# EAGLE schematic devboard_kw2xd_v2.0 (EAGLE 8.4.1)
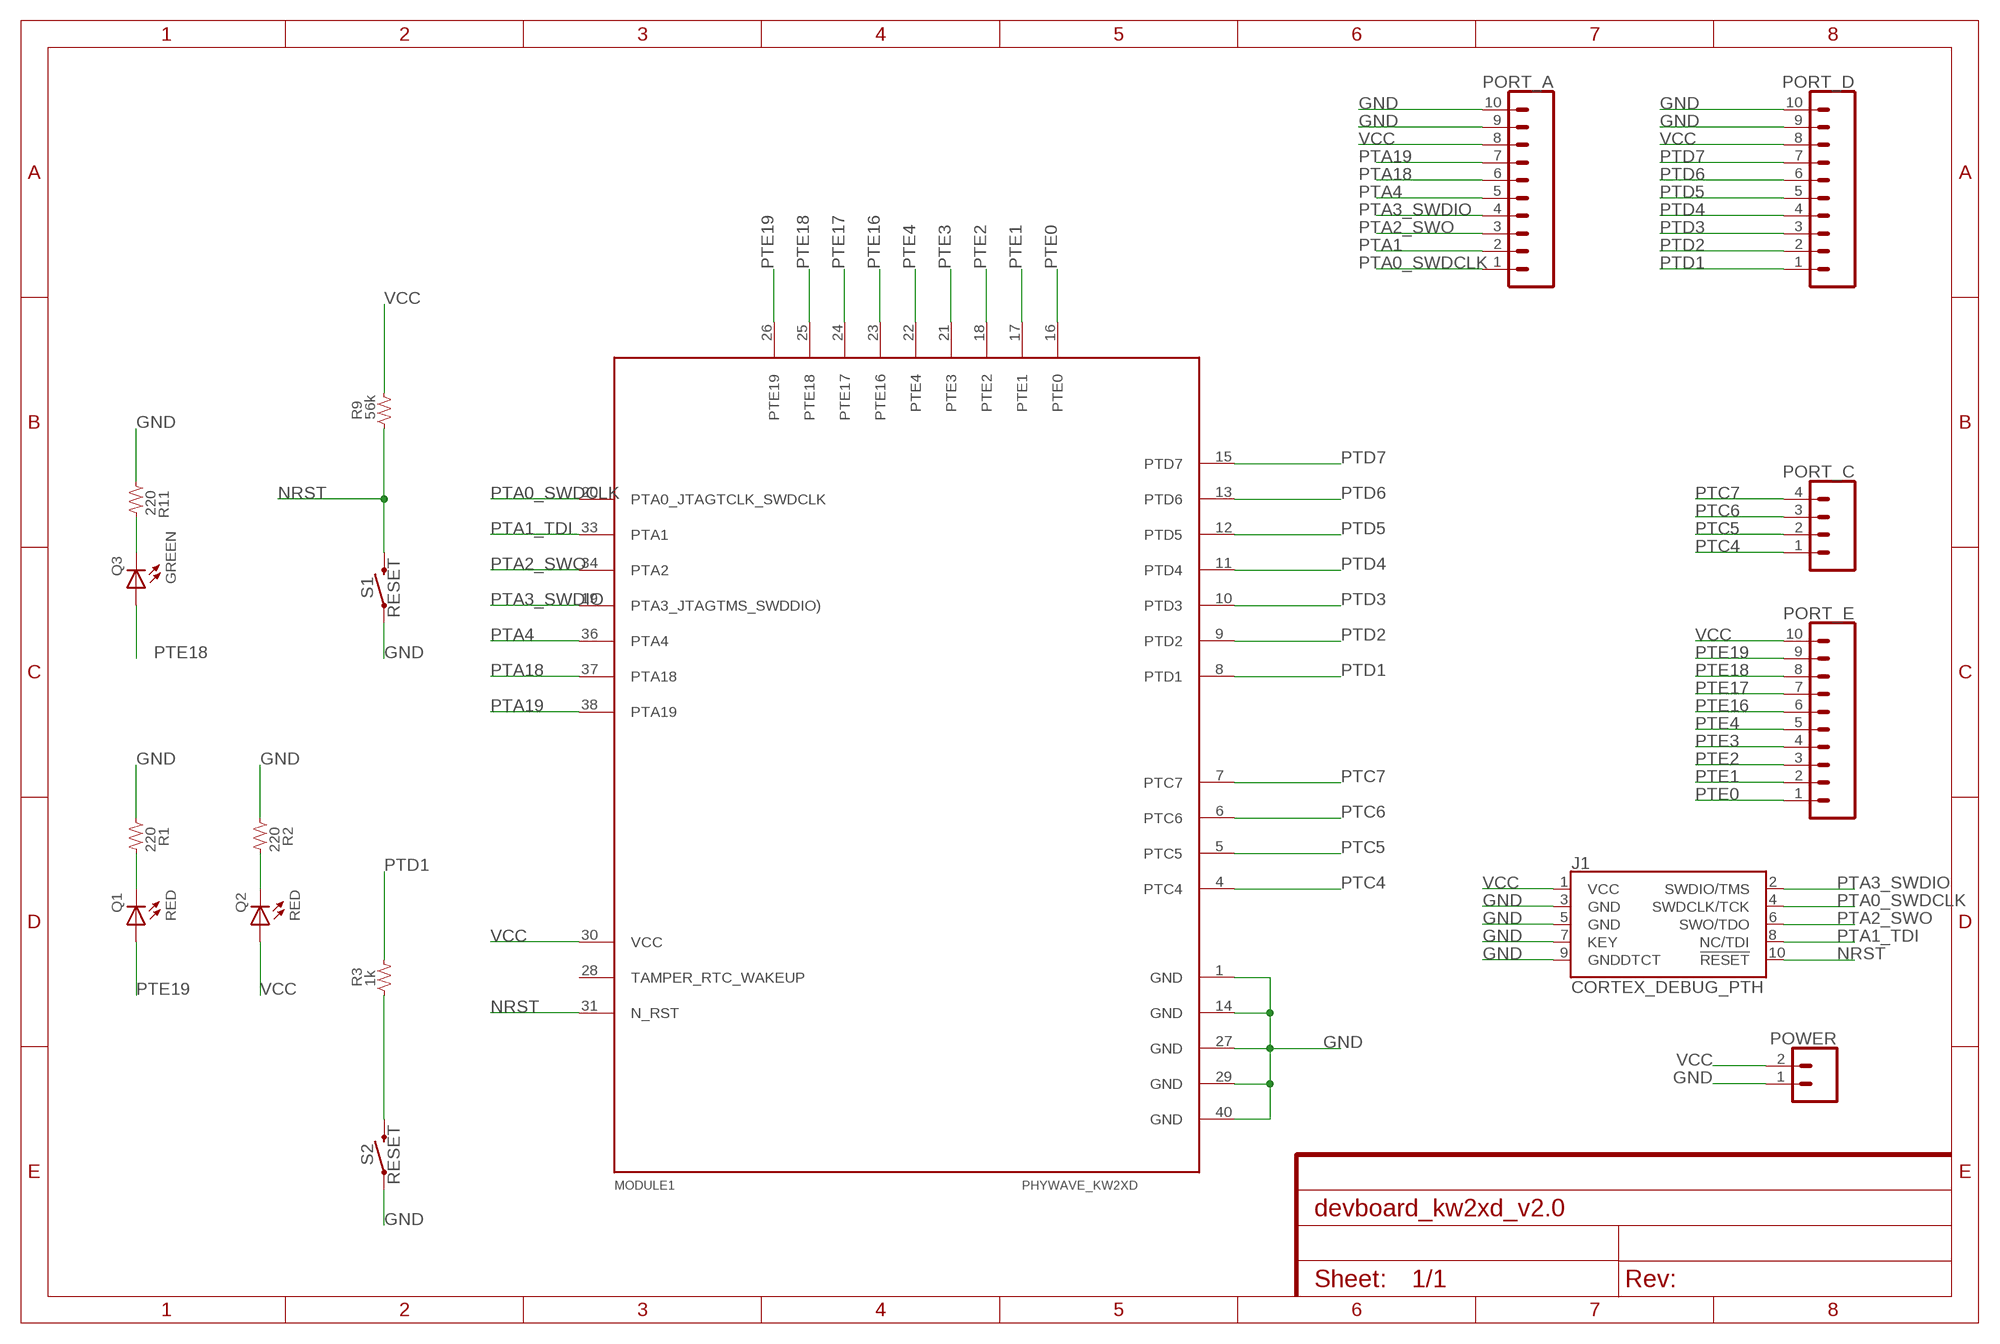
[diagram p0: schematic, sheet 1]
FRAME1 (FRAME-A4L): CNAME: OFLMote KW2xD Dev. Board; CREVISION: v1.0; DESIGNER: O.Fauchon - OFLMetrics 2018

## Parts
J1  CORTEX_DEBUG_PTH  [2X5-PTH-1.27MM]
MODULE1  PHYWAVE_KW2XD  [PHYWAVE_KW2XD]
PORT_A  CONN_10"  [1X10]
PORT_C  CONN_04  [1X04]
PORT_D  CONN_10"  [1X10]
PORT_E  CONN_10"  [1X10]
POWER  CONN_02  [1X02]
Q1  RED  LED-0603  [LED0603]
Q2  RED  LED-0603  [LED0603]
Q3  GREEN  LED-0603  [LED0603]
R1  220  R-0603  [SMD0603]
R2  220  R-0603  [SMD0603]
R3  1k  R-0603  [SMD0603]
R9  56k  R-0603  [SMD0603]
R11  220  R-0603  [SMD0603]
S1  RESET  MOMENTARY-SWITCH-SPST-SMD-4.6X2.8MM  [TACTILE_SWITCH_SMD_4.6X2.8MM]
S2  RESET  MOMENTARY-SWITCH-SPST-SMD-4.6X2.8MM  [TACTILE_SWITCH_SMD_4.6X2.8MM]

## Nets
GND: J1.3(GND) J1.5(GND) J1.7(KEY) J1.9(GNDDTCT) MODULE1.1(GND) MODULE1.14(GND) MODULE1.27(GND) MODULE1.29(GND) MODULE1.40(GND) PORT_A.9 PORT_A.10 PORT_D.9 PORT_D.10 POWER.1 R1.1 R2.1 R11.1 S1.1 S1.2 S2.1 S2.2
N$1: Q1.C R1.2
N$2: Q2.C R2.2
N$20: Q3.C R11.2
NRST: J1.10(!RESET) MODULE1.31(N_RST) R3.1 R9.1 S1.3 S1.4 S2.3 S2.4
PTA0_SWDCLK: J1.4(SWDCLK/TCK) MODULE1.20(PTA0_JTAGTCLK_SWDCLK) PORT_A.1
PTA1: PORT_A.2
PTA1_TDI: J1.8(NC/TDI) MODULE1.33(PTA1)
PTA2_SWO: J1.6(SWO/TDO) MODULE1.34(PTA2) PORT_A.3
PTA3_SWDIO: J1.2(SWDIO/TMS) MODULE1.19(PTA3_JTAGTMS_SWDDIO)) PORT_A.4
PTA4: MODULE1.36(PTA4) PORT_A.5
PTA18: MODULE1.37(PTA18) PORT_A.6
PTA19: MODULE1.38(PTA19) PORT_A.7
PTC4: MODULE1.4(PTC4) PORT_C.1
PTC5: MODULE1.5(PTC5) PORT_C.2
PTC6: MODULE1.6(PTC6) PORT_C.3
PTC7: MODULE1.7(PTC7) PORT_C.4
PTD1: MODULE1.8(PTD1) PORT_D.1 R3.2
PTD2: MODULE1.9(PTD2) PORT_D.2
PTD3: MODULE1.10(PTD3) PORT_D.3
PTD4: MODULE1.11(PTD4) PORT_D.4
PTD5: MODULE1.12(PTD5) PORT_D.5
PTD6: MODULE1.13(PTD6) PORT_D.6
PTD7: MODULE1.15(PTD7) PORT_D.7
PTE0: MODULE1.16(PTE0) PORT_E.1
PTE1: MODULE1.17(PTE1) PORT_E.2
PTE2: MODULE1.18(PTE2) PORT_E.3
PTE3: MODULE1.21(PTE3) PORT_E.4
PTE4: MODULE1.22(PTE4) PORT_E.5
PTE16: MODULE1.23(PTE16) PORT_E.6
PTE17: MODULE1.24(PTE17) PORT_E.7
PTE18: MODULE1.25(PTE18) PORT_E.8 Q3.A
PTE19: MODULE1.26(PTE19) PORT_E.9 Q1.A
VCC: J1.1(VCC) MODULE1.30(VCC) PORT_A.8 PORT_D.8 PORT_E.10 POWER.2 Q2.A R9.2
Unconnected: MODULE1.28(TAMPER_RTC_WAKEUP)

## Library data of the parts
J1 = SparkFun-Connectors:CORTEX_DEBUG: Cortex Debug Connector - 10 pin Supports JTAG debug, Serial Wire debug, and Serial Wire Viewer. PTH and SMD connector options available. General Connector Information <http://infocenter.arm.com/help/topic/com.arm.doc.faqs/attached/13634/cortex_debug_connectors.pdf> Products: PTH Connector <http://www.digikey.com/product-detail/en/cnc-tech/3220-10-0100-00/1175-1627-ND/3883661> -via Digi-Key SparkFun PSoc <https://www.sparkfun.com/products/13229> SparkFun T <https://www.sparkfun.com/products/13810>
MODULE1 = oflabs-phytec:PHYWAVE_KW2XD
PORT_A PORT_D PORT_E = SparkFun-Connectors:CONN_10: Multi connection point. Often used as Generic Header-pin footprint for 0.1 inch spaced/style header connections On any of the 0.1 inch spaced packages, you can populate with these: Break Away Headers - Straight <https://www.sparkfun.com/products/116> (PRT-00116) Break Away Male Headers - Right Angle <https://www.sparkfun.com/products/553> (PRT-00553) Female Headers <https://www.sparkfun.com/products/115> (PRT-00115) Break Away Headers - Machine Pin <https://www.sparkfun.com/products/117> (PRT-00117) Break Away Female Headers - Swiss Machine Pin <https://www.sparkfun.com/products/743> (PRT-00743) Arduino Stackable Header - 10 Pin <https://www.sparkfun.com/products/11376> (PRT-11376) For SCREWTERMINALS and SPRING TERMINALS visit here: Screw Terimnals on SparkFun.com <https://www.sparkfun.com/search/results?term=Screw+Terminals> (5mm/3.5mm/2.54mm spacing) This device is also useful as a general connection point to wire up your design to another part of your project. Our various solder wires solder well into these plated through hole pads. Hook-Up Wire - Assortment (Stranded, 22 AWG) <https://www.sparkfun.com/products/11375> (PRT-11375) Hook-Up Wire - Assortment (Solid Core, 22 AWG) <https://www.sparkfun.com/products/11367> (PRT-11367) View the entire wire category on our website here <https://www.sparkfun.com/categories/141> Special notes: Molex polarized connector foot print use with SKU : PRT-08231 with associated crimp pins and housings. 1MM SMD Version SKU: PRT-10208 NOTES ON THE VARIANTS LOCK and LOCK_LONGPADS... This footprint was designed to help hold the alignment of a through-hole component (i.e. 6-pin header) while soldering it into place. You may notice that each hole has been shifted either up or down by 0.005 of an inch from it's more standard position (which is a perfectly straight line). This slight alteration caused the pins (the squares in the middle) to touch the edges of the holes. Because they are alternating, it causes a "brace" to hold the component in place. 0.005 has proven to be the perfect amount of "off-center" position when using our standard breakaway headers. Although looks a little odd when you look at the bare footprint, once you have a header in there, the alteration is very hard to notice. Also,if you push a header all the way into place, it is covered up entirely on the bottom side.; PROD_ID: CONN-11563
PORT_C = SparkFun-Connectors:CONN_04: Multi connection point. Often used as Generic Header-pin footprint for 0.1 inch spaced/style header connections On any of the 0.1 inch spaced packages, you can populate with these: Break Away Headers - Straight <https://www.sparkfun.com/products/116> (PRT-00116) Break Away Male Headers - Right Angle <https://www.sparkfun.com/products/553> (PRT-00553) Female Headers <https://www.sparkfun.com/products/115> (PRT-00115) Break Away Headers - Machine Pin <https://www.sparkfun.com/products/117> (PRT-00117) Break Away Female Headers - Swiss Machine Pin <https://www.sparkfun.com/products/743> (PRT-00743) For SCREWTERMINALS and SPRING TERMINALS visit here: Screw Terimnals on SparkFun.com <https://www.sparkfun.com/search/results?term=Screw+Terminals> (5mm/3.5mm/2.54mm spacing) This device is also useful as a general connection point to wire up your design to another part of your project. Our various solder wires solder well into these plated through hole pads. Hook-Up Wire - Assortment (Stranded, 22 AWG) <https://www.sparkfun.com/products/11375> (PRT-11375) Hook-Up Wire - Assortment (Solid Core, 22 AWG) <https://www.sparkfun.com/products/11367> (PRT-11367) View the entire wire category on our website here <https://www.sparkfun.com/categories/141> Special notes: Molex polarized connector foot print use with SKU : PRT-08231 with associated crimp pins and housings. 1MM SMD Version SKU: PRT-10208; PROD_ID: CONN-09696
POWER = SparkFun-Connectors:CONN_02: Multi connection point. Often used as Generic Header-pin footprint for 0.1 inch spaced/style header connections On any of the 0.1 inch spaced packages, you can populate with these: Break Away Headers - Straight <https://www.sparkfun.com/products/116> (PRT-00116) Break Away Male Headers - Right Angle <https://www.sparkfun.com/products/553> (PRT-00553) Female Headers <https://www.sparkfun.com/products/115> (PRT-00115) Break Away Headers - Machine Pin <https://www.sparkfun.com/products/117> (PRT-00117) Break Away Female Headers - Swiss Machine Pin <https://www.sparkfun.com/products/743> (PRT-00743) For SCREWTERMINALS and SPRING TERMINALS visit here: Screw Terimnals on SparkFun.com <https://www.sparkfun.com/search/results?term=Screw+Terminals> (5mm/3.5mm/2.54mm spacing) This device is also useful as a general connection point to wire up your design to another part of your project. Our various solder wires solder well into these plated through hole pads. Hook-Up Wire - Assortment (Stranded, 22 AWG) <https://www.sparkfun.com/products/11375> (PRT-11375) Hook-Up Wire - Assortment (Solid Core, 22 AWG) <https://www.sparkfun.com/products/11367> (PRT-11367) View the entire wire category on our website here <https://www.sparkfun.com/categories/141> Special notes: Molex polarized connector foot print use with: PRT-08233 with associated crimp pins and housings. 2.54_SCREWTERM for use with PRT-10571. 3.5mm Screw Terminal footprints for PRT-08084 5mm Screw Terminal footprints for use with PRT-08432
Q1-Q3 = parts:LED
R1-R3 R9 R11 = parts:R
S1 S2 = SparkFun-Switches:MOMENTARY-SWITCH-SPST: Momentary Switch (Pushbutton) - SPST Normally-open (NO) SPST momentary switches (buttons, pushbuttons). Variants PTH-12MM - 12mm square, through-hole Momentary Pushbutton Switch - 12mm Square <https://www.sparkfun.com/products/9190> (COM-09190) PTH-6.0MM, PTH-6.0MM-KIT - 6.0mm square, through-hole Mini Pushbutton Switch <https://www.sparkfun.com/products/97> (COM-00097) KIT package intended for soldering kit's - only one side of pads' copper is exposed. PTH-RIGHT-ANGLE-KIT - Right-angle, through-hole Right Angle Tactile Button <https://www.sparkfun.com/products/10791> - Used on SparkFun BigTime Watch Kit <https://www.sparkfun.com/products/11734> SMD-12MM - 12mm square, surface-mount Tactile Button - SMD (12mm) <https://www.sparkfun.com/products/12993> (COM-12993) Used on SparkFun PicoBoard <https://www.sparkfun.com/products/11888> SMD-4.5MM - 4.5mm Square Trackball Switch Used on SparkFun Blackberry Trackballer Breakout <https://www.sparkfun.com/products/13169> SMD-4.6MMX2.8MM - 4.60mm x 2.80mm, surface mount Used on SparkFun SAMD21 Mini Breakout <https://www.sparkfun.com/products/13664> SMD-5.2MM, SMD-5.2-REDUNDANT - 5.2mm square, surface-mount Mini Pushbutton Switch - SMD <https://www.sparkfun.com/products/8720> (COM-08720) Used on Arduino Pro Mini <https://www.sparkfun.com/products/11114> REDUNDANT package connects both switch circuits together SMD-6.0X3.5MM - 6.0 x 3.5mm, surface mount Momentary Reset Switch SMD <https://www.sparkfun.com/products/8229> (COM-08229) SMD-6.2MM-TALL - 6.2mm square, surface mount Tactile Button - SMD (6mm) <https://www.sparkfun.com/products/12992> Used on SparkFun Digital Sandbox <https://www.sparkfun.com/products/12651> SMD-RIGHT-ANGLE - Right-angle, surface mount Used on SparkFun Block for Intel® Edison - Arduino <https://www.sparkfun.com/products/13036>; PROD_ID: SWCH-13065